# Altium project Teclado_Tartilope_V2.0.PrjPcb
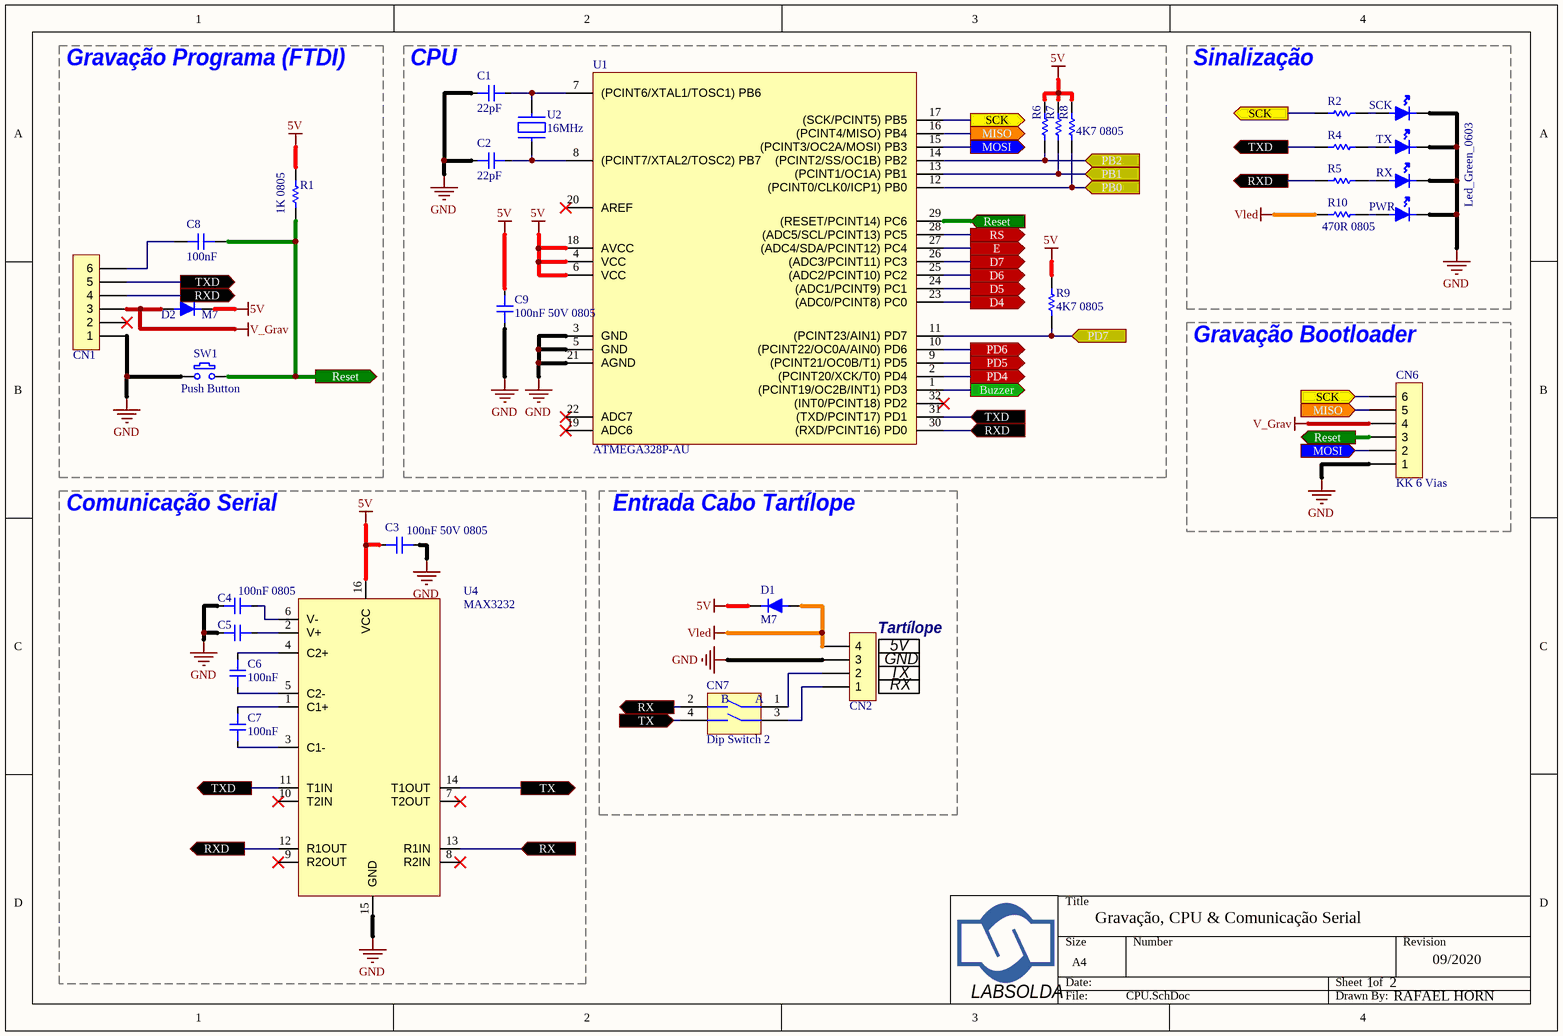
[diagram p0: CPU.SchDoc]
2 sheets, 50 parts. Net scope: flat (ports and power ports of the same name join across sheets).
Board file: PCB_IHM.PcbDoc
Sheets:
  CPU.SchDoc
  Perifericos.SchDoc

## Sheet CPU.SchDoc
size A4

### Parts
C1  22pF  [100nF 0805]
C2  22pF  [100nF 0805]
C3  100nF 50V 0805  [100nF 0805]
C4  100nF 50V 0805  [100nF 0805]  (value not drawn)
C5  100nF 0805  [100nF 0805]
C6  100nF  [100nF 0805]
C7  100nF  [100nF 0805]
C8  100nF  [5mm film]
C9  100nF 50V 0805  [100nF 0805]
CN1  Barra Pinos M  [Barra Pino M 6]  (value not drawn)
CN2  STLZ 4 Vias  [STLZ 4 5.08mm]  (value not drawn)
CN6  KK 6 Vias  [KK_6W_.100]
CN7  Dip Switch 2  [DIP_SWITCH_2]
D1  M7  [DO-214AC SMA]
D2  M7  [DO-214AC SMA]
PWR  Green_0603  [Green Led 0603]  (value not drawn)
R1  1K 0805  [0805 - 1K 1%]
R2  470R 0805  [0805 - 470R 1%]  (value not drawn)
R4  470R 0805  [0805 - 470R 1%]  (value not drawn)
R5  470R 0805  [0805 - 470R 1%]  (value not drawn)
R6  4K7  [0805 - 2k7 1%]  (value not drawn)
R7  4K7  [0805 - 2k7 1%]  (value not drawn)
R8  4K7 0805  [0805 - 2k7 1%]
R9  4K7 0805  [0805 - 2k7 1%]
R10  470R 0805  [0805 - 470R 1%]
RX  Green_0603  [Green Led 0603]  (value not drawn)
SCK  Led_Green_0603  [Green Led 0603]
SW1  Push Button  [Chave Tactil 6x6x5]
TX  Green_0603  [Green Led 0603]  (value not drawn)
U1  ATMEGA328P-AU  [LQFP-32]
U2  16MHz  [HC49]
U4  MAX3232  [DIP16-300(100)]

### Blocks framed on the sheet
Gravação Programa (FTDI): C8 CN1 D2 R1 SW1
CPU: C1 C2 C9 R6-R9 U1 U2
Sinalização: PWR R2 R4 R5 R10 RX SCK TX
Gravação Bootloader: CN6
Comunicação Serial: C3-C7 U4
Entrada Cabo Tartílope: CN2 CN7 D1

### Ports
Buzzer (out), D4 (out), D5 (out), D6 (out), D7 (out), E (out), MISO (in), MISO (out), MOSI (in), MOSI (out), PB0 (in), PB1 (in), PB2 (in), PD4 (out), PD5 (out), PD6 (out), PD7 (in), Reset (in), Reset (out), RS (out), RX (in), RX (out), RXD (in), RXD (out), SCK (in), SCK (out), TX (in), TX (out), TXD (in), TXD (out)

### Nets
5V: C3.2 C9.2 D1.K D2.K R1.2 R6.2 R7.2 R8.2 R9.2 U1.4(VCC) U1.6(VCC) U1.18(AVCC) U4.16(VCC)
GND: C1.1 C2.1 C3.1 C4.1 C5.1 C9.1 CN1.1 CN2.3 CN6.1 PWR.K RX.K SCK.K SW1.1 TX.K U1.3(GND) U1.5(GND) U1.21(AGND) U4.15(GND)
V_Grav: CN1.3 CN6.4 D2.A
Vled: CN2.4 D1.A R10.1
NetC1_2: C1.2 U1.7((PCINT6/XTAL1/TOSC1)_PB6) U2.1
NetC2_2: C2.2 U1.8((PCINT7/XTAL2/TOSC2)_PB7) U2.2
NetC4_2: C4.2 U4.6(V-)
NetC5_2: C5.2 U4.2(V+)
NetC6_1: C6.1 U4.5(C2-)
NetC6_2: C6.2 U4.4(C2+)
NetC7_1: C7.1 U4.3(C1-)
NetC7_2: C7.2 U4.1(C1+)
NetC8_1: C8.1 CN1.6
NetC8_2: C8.2 CN6.3 R1.1 SW1.2 U1.29((RESET/PCINT14)_PC6) ; port Reset
NetCN1_4: CN1.4 R5.1 U1.30((RXD/PCINT16)_PD0) U4.12(R1OUT) ; port RXD
NetCN1_5: CN1.5 R4.1 U1.31((TXD/PCINT17)_PD1) U4.11(T1IN) ; port TXD
NetCN2_1: CN2.1 CN7.3(2A)
NetCN2_2: CN2.2 CN7.1(1A)
NetCN3_3: U1.28((ADC5/SCL/PCINT13)_PC5) ; port RS
NetCN3_5: U1.27((ADC4/SDA/PCINT12)_PC4) ; port E
NetCN3_11: U1.24((ADC1/PCINT9)_PC1) ; port D5
NetCN3_12: U1.23((ADC0/PCINT8)_PC0) ; port D4
NetCN3_13: U1.26((ADC3/PCINT11)_PC3) ; port D7
NetCN3_14: U1.25((ADC2/PCINT10)_PC2) ; port D6
NetCN5_1: R7.1 U1.13((PCINT1/OC1A)_PB1) ; port PB1
NetCN5_2: R6.1 U1.14((PCINT2/SS/OC1B)_PB2) ; port PB2
NetCN5_3: R9.1 U1.11((PCINT23/AIN1)_PD7) ; port PD7
NetCN5_4: U1.9((PCINT21/OC0B/T1)_PD5) ; port PD5
NetCN6_2: CN6.2 U1.15((PCINT3/OC2A/MOSI)_PB3) ; port MOSI
NetCN6_5: CN6.5 U1.16((PCINT4/MISO)_PB4) ; port MISO
NetCN6_6: CN6.6 R2.1 U1.17((SCK/PCINT5)_PB5) ; port SCK
NetCN7_2: CN7.2(1B) U4.13(R1IN) ; port RX
NetCN7_4: CN7.4(2B) U4.14(T1OUT) ; port TX
NetPWR_A: PWR.A R10.2
NetR2_2: R2.2 SCK.A
NetR3_1: U1.1((PCINT19/OC2B/INT1)_PD3) ; port Buzzer
NetR4_2: R4.2 TX.A
NetR5_2: R5.2 RX.A
NetR8_1: R8.1 U1.12((PCINT0/CLK0/ICP1)_PB0) ; port PB0
NetSW8_2: U1.10((PCINT22/OC0A/AIN0)_PD6) ; port PD6
NetSW8_10: U1.2((PCINT20/XCK/T0)_PD4) ; port PD4

Not connected (* = marked no-connect by the designer): CN1 2*; U1 19(ADC6)* 20(AREF)* 22(ADC7)* 32((INT0/PCINT18)_PD2)*; U4 7(T2OUT)* 8(R2IN)* 9(R2OUT)* 10(T2IN)*

### Notes on the sheet
- (near CN2) Tartílope
- (near CN2) 5V
- (near CN2) GND
- (near CN2) TX
- (near CN2) RX
- Gravação, CPU & Comunicação Serial
- 1
- 2
- 09/2020
- LABSOLDA
- RAFAEL HORN
- (in symbol Dip Switch 2 Vias) B; A

### Library data of the parts
C1-C7 C9 = 100nF 16V 0805: Capacitor 0805 100nF 16V
C8 = 100nF 63V: FILM CAPACITORS 100nF 63V
CN1 = Barra Pino M 6: Barra Pino Macho 6 Vias 2.54mm
CN2 = STLZ 4 Vias: Conector Socket STLZ 4 Vias 5.08mm
CN6 = KK 6 Vias: Conector Placa KK 6 Vias 2.54mm
CN7 = Dip Switch 2 Vias: DIP Switches / SIP Switches Dip switch Slide Type; Partnumber: NDSR-02V; Manufacturer: Diptronics; Datasheet: https://br.mouser.com/datasheet/2/910/DS_1-1571341.pdf
D1 D2 = M7: 1A Rectifier Diodes
PWR RX SCK TX = Green 0603: LED GREEN CLEAR 0603 SMD PN 150060VS75000
R1 = 1K - 0805: Resistor SMD 0805 1K
R2 R4 R5 R10 = 470R - 0805: Resistor SMD 0805 470R
R6-R9 = 2K7 - 0805: Resistor SMD 0805 2K7
SW1 = Push Button: Chave Tactil 4 terminais 6x6x5mm - KFC-A06
U1 = ATMEGA328P: 8-bit AVR Microcontroller with 32K Bytes In-System  Programmable Flash
U2 = Crystal 16MHz: 16MHZ OSCILATOR CRYSTAL
U4 = MAX3232: MAX3232 3-V to 5.5-V Multichannel RS-232 Line Driver/Receiver  With ±15-kV ESD Protection

## Sheet Perifericos.SchDoc
size A4
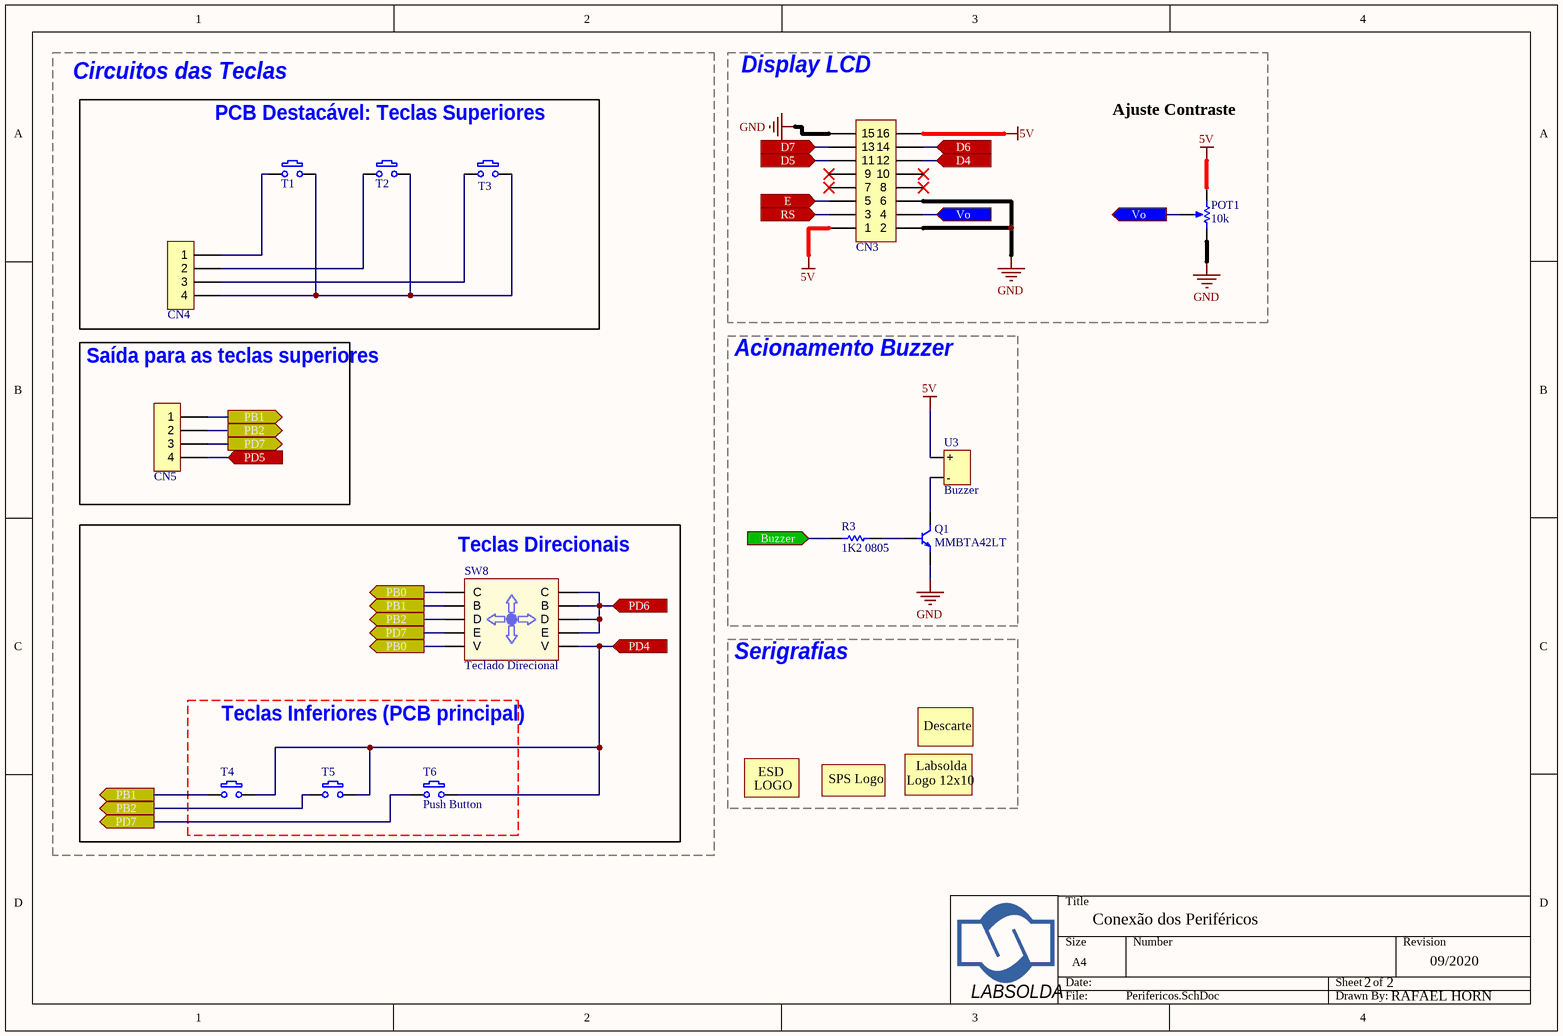
[diagram p1: Perifericos.SchDoc]

### Parts
CN3  Header 16 Vias  [Header 16 180º PCI]  (value not drawn)
CN4  KK 4 Vias  [KK_4W_.100]  (value not drawn)
CN5  KK 4 Vias  [KK_4W_.100]  (value not drawn)
Logo1  ESD 7x6  [ESD 7x6]  (value not drawn)  (no BOM)
Logo2  SPS  [SPS]  (value not drawn)  (no BOM)
Logo3  Labsolda12x10  [LABSOLDA 12x10]  (value not drawn)  (no BOM)
Logo4  Descarte  [DESCARTE7x7]  (value not drawn)  (no BOM)
POT1  10k  [3386]
Q1  MMBTA42LT  [SOT-23]
R3  1K2 0805  [0805 - 1K2 1%]
SW8  Teclado Direcional  [Teclado_Direcional]
T1  Push Button  [Chave Tactil 6x6x5]  (value not drawn)
T2  Push Button  [Chave Tactil 6x6x5]  (value not drawn)
T3  Push Button  [Chave Tactil 6x6x5]  (value not drawn)
T4  Push Button  [Chave Tactil 6x6x5]  (value not drawn)
T5  Push Button  [Chave Tactil 6x6x5]  (value not drawn)
T6  Push Button  [Chave Tactil 6x6x5]
U3  Buzzer  [Buzzer]

### Blocks framed on the sheet
Display LCD: CN3 POT1
PCB Destacável: Teclas Superiores: CN4 T1-T3
Saída para as teclas superiores: CN5
Acionamento Buzzer: Q1 R3 U3
Teclas Direcionais: SW8
Serigrafias: Logo1-Logo4
Teclas Inferiores (PCB principal): T4-T6

### Ports
Buzzer (in), D4 (in), D5 (in), D6 (in), D7 (in), E (in), PB0 (out), PB1 (out), PB2 (out), PD4 (in), PD5 (in), PD6 (in), PD7 (out), RS (in), Vo (in), Vo (out)

### Nets
5V: CN3.1 CN3.16 POT1.1(TOP) U3.1(+)
GND: CN3.2 CN3.6 CN3.15 POT1.2(BOT) Q1.E
NetCN3_3: CN3.3 ; port RS
NetCN3_4: CN3.4 POT1.3(TAP) ; port Vo
NetCN3_5: CN3.5 ; port E
NetCN3_11: CN3.11 ; port D5
NetCN3_12: CN3.12 ; port D4
NetCN3_13: CN3.13 ; port D7
NetCN3_14: CN3.14 ; port D6
NetCN4_1: CN4.1 T1.2
NetCN4_2: CN4.2 T2.2
NetCN4_3: CN4.3 T3.1
NetCN4_4: CN4.4 T1.1 T2.1 T3.2
NetCN5_1: CN5.1 SW8.3(B) T4.1 ; port PB1
NetCN5_2: CN5.2 SW8.5(D) T5.1 ; port PB2
NetCN5_3: CN5.3 SW8.7(E) T6.1 ; port PD7
NetCN5_4: CN5.4 ; port PD5
NetQ1_B: Q1.B R3.2
NetQ1_C: Q1.C U3.2(-)
NetR3_1: R3.1 ; port Buzzer
NetR8_1: SW8.1(C) SW8.9(V) ; port PB0
NetSW8_2: SW8.2(C) SW8.4(B) SW8.6(D) SW8.8(E) ; port PD6
NetSW8_10: SW8.10(V) T4.2 T5.2 T6.2 ; port PD4

Not connected (* = marked no-connect by the designer): CN3 7* 8* 9* 10*

### Notes on the sheet
- Circuitos das Teclas
- Ajuste Contraste
- Conexão dos Periféricos
- 2
- 09/2020
- LABSOLDA
- RAFAEL HORN
- (in symbol ESD 7x6) ESD; LOGO
- (in symbol Labsolda12x10) Labsolda; Logo 12x10
- (in symbol SPS) SPS Logo

### Library data of the parts
CN3 = Header 16 180º: Conector Placa Macho 16 Vias C/ guia 180º 2.54mm
CN4 CN5 = KK 4 Vias: Conector Placa KK 4 Vias 2.54mm
POT1 = Pot_3386: Trimpot Horizontal 3386
Q1 = MMBTA42LT: High Voltage Transistors NPN Silicon 300V 500mA
R3 = 1K2 - 0805: Resistor SMD 0805 1K2
SW8 = Teclado Direcional: Teclado Direcional associando botões Multimec
T1-T6 = Push Button: as SW1 on sheet CPU
U3 = Buzzer 5V: Buzzers Indicator, Internally Driven Magnetic 5V 30mA 2.73kHz 82dB @ 5V, 10cm Through Hole PC Pins; Partnumber: AI-1027-TWT-5V-2-R

## Nets that join several sheets
5V: CPU (13 pins), Perifericos (CN3.1 CN3.16 POT1.1 U3.1)
GND: CPU (18 pins), Perifericos (5 pins)
NetCN3_3: CPU (U1.28), Perifericos (CN3.3)
NetCN3_5: CPU (U1.27), Perifericos (CN3.5)
NetCN3_11: CPU (U1.24), Perifericos (CN3.11)
NetCN3_12: CPU (U1.23), Perifericos (CN3.12)
NetCN3_13: CPU (U1.26), Perifericos (CN3.13)
NetCN3_14: CPU (U1.25), Perifericos (CN3.14)
NetCN5_1: CPU (R7.1 U1.13), Perifericos (CN5.1 SW8.3 T4.1)
NetCN5_2: CPU (R6.1 U1.14), Perifericos (CN5.2 SW8.5 T5.1)
NetCN5_3: CPU (R9.1 U1.11), Perifericos (CN5.3 SW8.7 T6.1)
NetCN5_4: CPU (U1.9), Perifericos (CN5.4)
NetR3_1: CPU (U1.1), Perifericos (R3.1)
NetR8_1: CPU (R8.1 U1.12), Perifericos (SW8.1 SW8.9)
NetSW8_2: CPU (U1.10), Perifericos (SW8.2 SW8.4 SW8.6 SW8.8)
NetSW8_10: CPU (U1.2), Perifericos (SW8.10 T4.2 T5.2 T6.2)